# EAGLE schematic cc2500 (EAGLE 7.1.0)
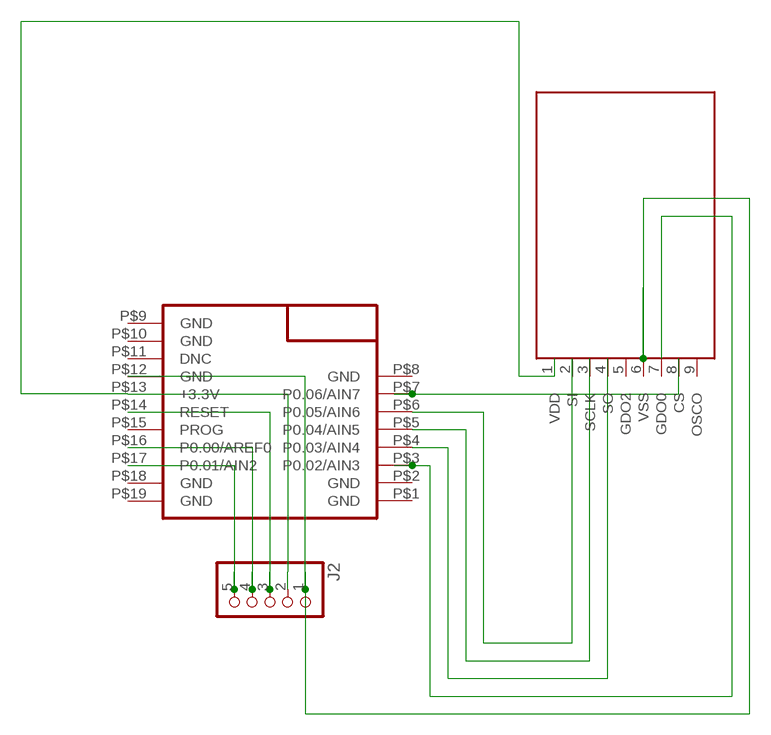
[diagram p0: schematic, sheet 1]

## Parts
J2  PINHD-1X5  [1X05]
U$1  RFD22301  [RFD21733]
U$2  CC2500-RADIO  [CC2500BOARD]

## Nets
N$3: U$1.P$3(P0.02/AIN3) U$2.7(GDO0)
N$4: J2.1 U$1.P$12(GND) U$2.6(VSS)
N$5: J2.3 U$1.P$14(RESET)
N$6: U$1.P$7(P0.06/AIN7) U$2.8(CS)
N$7: U$1.P$4(P0.03/AIN4) U$2.4(SO)
N$8: U$1.P$5(P0.04/AIN5) U$2.3(SCLK)
N$9: U$1.P$6(P0.05/AIN6) U$2.2(SI)
N$11: J2.4 U$1.P$16(P0.00/AREF0)
N$12: J2.5 U$1.P$17(P0.01/AIN2)
N$20: J2.2 U$1.P$13(+3.3V) U$2.1(VDD)
Unconnected: U$1.P$1(GND) U$1.P$2(GND) U$1.P$8(GND) U$1.P$9(GND) U$1.P$10(GND) U$1.P$11(DNC) U$1.P$15(PROG) U$1.P$18(GND) U$1.P$19(GND) U$2.5(GDO2) U$2.9(OSCO)

## Library data of the parts
J2 = pinhead:PINHD-1X5: PIN HEADER
U$1 = RFD22301-11.25.13:RFD22301: RF Digital RFD22301
U$2 = cc2500-radio:CC2500-RADIO